# EAGLE design optiMiceV2 (EAGLE 9.6.2)
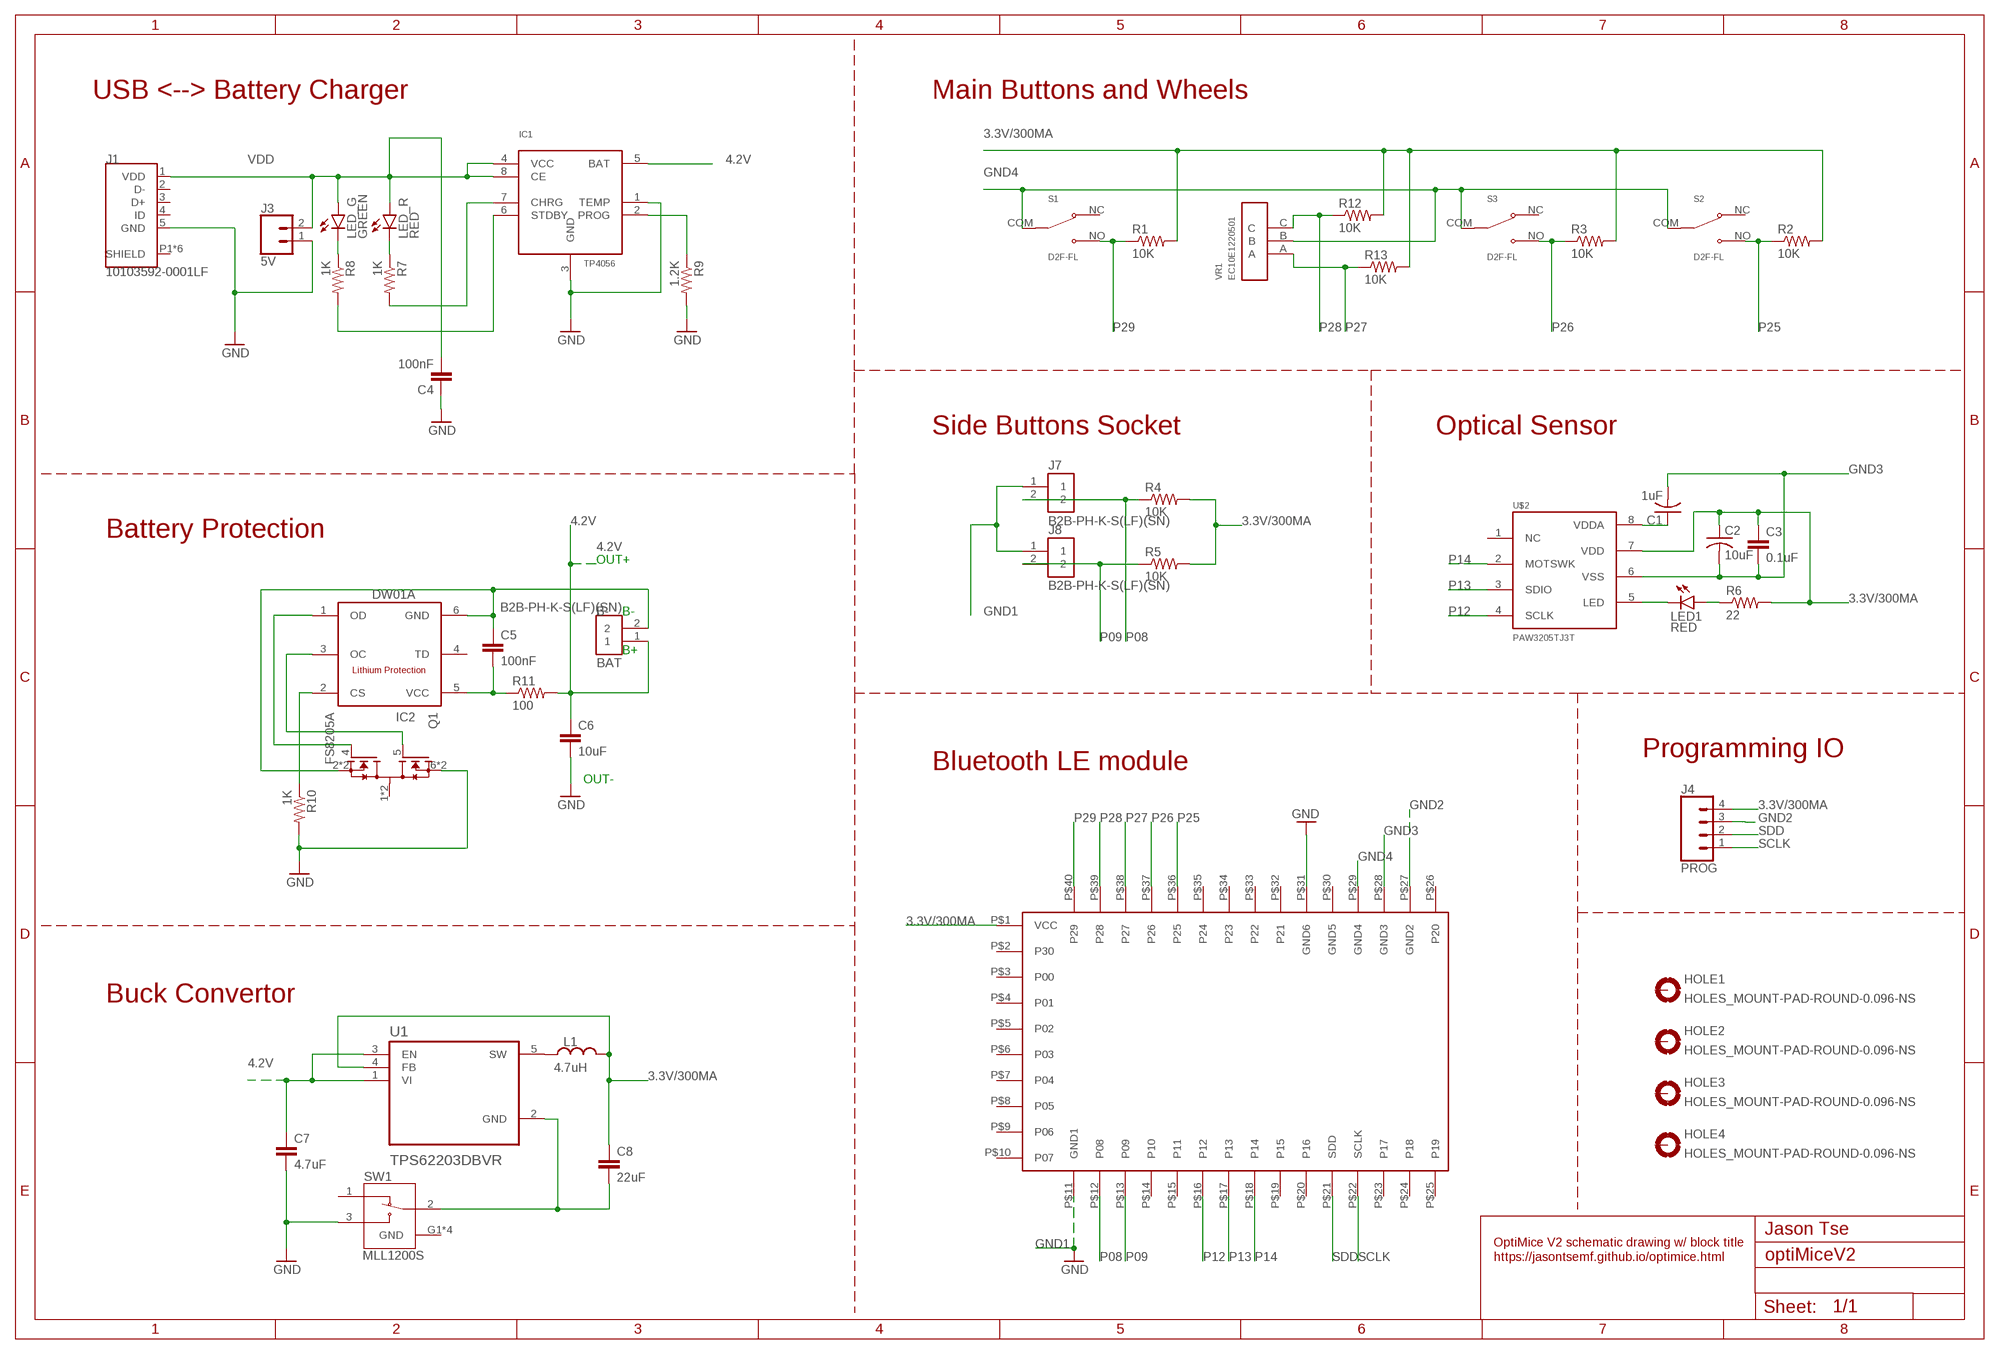
[diagram p0: schematic, sheet 1]

## Parts
BAT  B2B-PH-K-S(LF)(SN)  [JST_B2B-PH-K-S(LF)(SN)]
C1  1uF  C-USC0805K  [C0805K]
C2  10uF  C-USC0805K  [C0805K]
C3  0.1uF  C-EUC0805K  [C0805K]
C4  100nF  C-EUC0805  [C0805]
C5  100nF  C-EUC0805  [C0805]
C6  10uF  C-EUC0805  [C0805]
C7  4.7uF  C-EUC0805  [C0805]
C8  22uF  C-EUC0805  [C0805]
HOLE1  HOLES_MOUNT-PAD-ROUND-0.096-NS  [HOLES_096-PAD-NS]
HOLE2  HOLES_MOUNT-PAD-ROUND-0.096-NS  [HOLES_096-PAD-NS]
HOLE3  HOLES_MOUNT-PAD-ROUND-0.096-NS  [HOLES_096-PAD-NS]
HOLE4  HOLES_MOUNT-PAD-ROUND-0.096-NS  [HOLES_096-PAD-NS]
IC1  TP4056  [SOP-8]
IC2  DW01A  [SOT23-6]
J1  10103592-0001LF  [AMPHENOL_10103592-0001LF]
J3  5V  CONN_02  [1X02]
J4  PROG  CONN_04  [1X04]
J7  B2B-PH-K-S(LF)(SN)  [JST_B2B-PH-K-S(LF)(SN)]
J8  B2B-PH-K-S(LF)(SN)  [JST_B2B-PH-K-S(LF)(SN)]
L1  4.7uH  L_CHIP-0805(2012-METRIC)  [INDC2009X120]
LED1  RED  LED5MM  [LED5MM]
LED_G  GREEN  LEDCHIP-LED0805  [CHIP-LED0805]
LED_R  RED  LEDCHIP-LED0805  [CHIP-LED0805]
Q1  FS8205A  [SOP65P640X120-8N]
R1  10K  R-US_R0805  [R0805]
R2  10K  R-US_R0805  [R0805]
R3  10K  R-US_R0805  [R0805]
R4  10K  R-US_R0805  [R0805]
R5  10K  R-US_R0805  [R0805]
R6  22  R-US_R0805  [R0805]
R7  1K  R-US_R0805  [R0805]
R8  1K  R-US_R0805  [R0805]
R9  1.2K  R-US_R0805  [R0805]
R10  1K  R-US_R0805  [R0805]
R11  100  R-US_R0805  [R0805]
R12  10K  R-US_R0805  [R0805]
R13  10K  R-US_R0805  [R0805]
S1  D2F-FL  [SW_D2F-FL]
S2  D2F-FL  [SW_D2F-FL]
S3  D2F-FL  [SW_D2F-FL]
SW1  MLL1200S  [SW_MLL1200S]
U1  TPS62203DBVR  [SOT95P280X145-5N]
U$1  NRF51822-02  [WT51822-S2]
U$2  PAW3205TJ3T  [PAW3205]
VR1  EC10E1220501  [TRIM_EC10E1220501]

## Nets
3.3V/300MA: C2.1 C3.1 C8.1 J4.4 L1.2 R1.2 R2.2 R3.2 R4.2 R5.2 R6.2 R12.2 R13.2 U1.4(FB) U$1.P$1(VCC) U$2.7(VDD)
4.2V: BAT.1 C6.1 C7.1 IC1.5(BAT) R11.2 U1.1(VI) U1.3(EN)
B-: BAT.2 C5.1 IC2.6(GND) Q1.2(S1) Q1.3(S1)
GND: C4.1 C6.2 C7.2 IC1.1(TEMP) IC1.3(GND) J1.5(GND) J3.1 Q1.6(S2) Q1.7(S2) R9.2 R10.2 SW1.3 U$1.P$31(GND6)
GND1: J7.1 J8.1 U$1.P$11(GND1) ; supply symbol labelled GND
GND2: J4.3 U$1.P$27(GND2)
GND3: C1.2 C2.2 C3.2 U$1.P$28(GND3) U$2.6(VSS)
GND4: S1.COM S2.COM S3.COM U$1.P$29(GND4) VR1.B
N$3: C1.1 U$2.8(VDDA)
N$7: LED1.A R6.1
N$9: IC1.7(CHRG) R7.2
N$11: LED1.K(C) U$2.5(LED)
N$14: IC1.6(STDBY) R8.2
N$15: LED_R.C R7.1
N$16: LED_G.C R8.1
N$17: C8.2 SW1.2 U1.2(GND)
N$18: IC1.2(PROG) R9.1
N$19: L1.1 U1.5(SW)
N$20: IC2.3(OC) Q1.5(G2)
N$22: IC2.1(OD) Q1.4(G1)
N$23: C5.2 IC2.5(VCC) R11.1
N$24: IC2.2(CS) R10.1
P08: J7.2 R4.1 U$1.P$12(P08)
P09: J8.2 R5.1 U$1.P$13(P09)
P12: U$1.P$16(P12) U$2.4(SCLK)
P13: U$1.P$17(P13) U$2.3(SDIO)
P14: U$1.P$18(P14) U$2.2(MOTSWK)
P25: R2.1 S2.NO U$1.P$36(P25)
P26: R3.1 S3.NO U$1.P$37(P26)
P27: R13.1 U$1.P$38(P27) VR1.A
P28: R12.1 U$1.P$39(P28) VR1.C
P29: R1.1 S1.NO U$1.P$40(P29)
SCLK: J4.1 U$1.P$22(SCLK)
SDD: J4.2 U$1.P$21(SDD)
VDD: C4.2 IC1.4(VCC) IC1.8(CE) J1.1(VDD) J3.2 LED_G.A LED_R.A
Unconnected: HOLE1.B096(MOUNT) HOLE2.B096(MOUNT) HOLE3.B096(MOUNT) HOLE4.B096(MOUNT) IC2.4(TD) J1.2(D-) J1.3(D+) J1.4(ID) Q1.1(D12) Q1.8(D12) S1.NC S2.NC S3.NC SW1.1 U$1.P$2(P30) U$1.P$3(P00) U$1.P$4(P01) U$1.P$5(P02) U$1.P$6(P03) U$1.P$7(P04) U$1.P$8(P05) U$1.P$9(P06) U$1.P$10(P07) U$1.P$14(P10) U$1.P$15(P11) U$1.P$19(P15) U$1.P$20(P16) U$1.P$23(P17) U$1.P$24(P18) U$1.P$25(P19) U$1.P$26(P20) U$1.P$30(GND5) U$1.P$32(P21) U$1.P$33(P22) U$1.P$34(P23) U$1.P$35(P24) U$2.1(NC)

## Notes on the sheet
- USB <--> Battery Charger | Main Buttons and Wheels
- Side Buttons Socket | Optical Sensor
- Battery Protection
- OUT+
- B-
- B+
- Programming IO
- Bluetooth LE module
- OUT-
- Buck Convertor
- Jason Tse
- OptiMice V2 schematic drawing w/ block title
  https://jasontsemf.github.io/optimice.html

## Power pins joined to a net without a drawn wire
GND: SW1.G1(GND) SW1.G2(GND) SW1.G3(GND) SW1.G4(GND)
SHIELD: J1.P1(SHIELD) J1.P2(SHIELD) J1.P3(SHIELD) J1.P4(SHIELD) J1.P5(SHIELD) J1.P6(SHIELD)

## Library data of the parts
BAT J7 J8 = B2B-PH-K-S_LF__SN_:B2B-PH-K-S(LF)(SN): PH Series 2 Position 2 mm Pitch Through Hole Top Entry Shrouded Header Check prices <https://pricing.snapeda.com/parts/B2B-PH-K-S%28LF%29%28SN%29/JST%20Sales/view-part?ref=eda>; AVAILABILITY: Good; DESCRIPTION: Connector Header Through Hole 2 position 0.079 (2.00mm); MF: JST Sales; MP: B2B-PH-K-S(LF)(SN); PACKAGE: None; PRICE: None; PURCHASE-URL: https://pricing.snapeda.com/search/part/B2B-PH-K-S(LF)(SN)/?ref=eda
C1 C2 = rcl:C-US: CAPACITOR, American symbol; SPICEPREFIX: C
C3-C8 = rcl:C-EU: CAPACITOR, European symbol; SPICEPREFIX: C
HOLE1-HOLE4 = 52101-101-REV-A_v16:HOLES_MOUNT-PAD-ROUND-: MOUNTING PAD, round; BOM: EXCLUDE
IC1 = TP4056:TP4056; AVAILABILITY: Unavailable; DESCRIPTION: Complete single cell Li-Ion battery with a constant current / constant voltage linear charger; MF: NanJing Top Power ASIC Corp.; MP: TP4056; PACKAGE: Package; PRICE: None
IC2 = DW01A:DW01A; AVAILABILITY: Unavailable; DESCRIPTION: One Cell Lithium-ion/Polymer Battery Protection IC; MF: Fortune Semiconductor; MP: DW01A; PACKAGE: SOT-23-6 Fortune Semiconductor; PRICE: None
J1 = 10103592-0001LF:10103592-0001LF: Conn Micro USB Type B RCP 5 POS 0.65mm Solder RA SMD 5 Terminal 1 Port T/R Check prices <https://pricing.snapeda.com/parts/10103592-0001LF/Amphenol%20ICC%20%28FCI%29/view-part?ref=eda>; AVAILABILITY: Good; DESCRIPTION: USB - micro B USB 2.0 Receptacle Connector 5 Position Surface Mount, Right Angle; Through Hole; MF: Amphenol ICC (FCI); MP: 10103592-0001LF; PACKAGE: None; PRICE: None; PURCHASE-URL: https://pricing.snapeda.com/search/part/10103592-0001LF/?ref=eda
J3 = SparkFun-Connectors:CONN_02: Multi connection point. Often used as Generic Header-pin footprint for 0.1 inch spaced/style header connections On any of the 0.1 inch spaced packages, you can populate with these: Break Away Headers - Straight <https://www.sparkfun.com/products/116> (PRT-00116) Break Away Male Headers - Right Angle <https://www.sparkfun.com/products/553> (PRT-00553) Female Headers <https://www.sparkfun.com/products/115> (PRT-00115) Break Away Headers - Machine Pin <https://www.sparkfun.com/products/117> (PRT-00117) Break Away Female Headers - Swiss Machine Pin <https://www.sparkfun.com/products/743> (PRT-00743) For SCREWTERMINALS and SPRING TERMINALS visit here: Screw Terimnals on SparkFun.com <https://www.sparkfun.com/search/results?term=Screw+Terminals> (5mm/3.5mm/2.54mm spacing) This device is also useful as a general connection point to wire up your design to another part of your project. Our various solder wires solder well into these plated through hole pads. Hook-Up Wire - Assortment (Stranded, 22 AWG) <https://www.sparkfun.com/products/11375> (PRT-11375) Hook-Up Wire - Assortment (Solid Core, 22 AWG) <https://www.sparkfun.com/products/11367> (PRT-11367) View the entire wire category on our website here <https://www.sparkfun.com/categories/141> Special notes: Molex polarized connector foot print use with: PRT-08233 with associated crimp pins and housings. 2.54_SCREWTERM for use with PRT-10571. 3.5mm Screw Terminal footprints for PRT-08084 5mm Screw Terminal footprints for use with PRT-08432
J4 = SparkFun-Connectors:CONN_04: Multi connection point. Often used as Generic Header-pin footprint for 0.1 inch spaced/style header connections On any of the 0.1 inch spaced packages, you can populate with these: Break Away Headers - Straight <https://www.sparkfun.com/products/116> (PRT-00116) Break Away Male Headers - Right Angle <https://www.sparkfun.com/products/553> (PRT-00553) Female Headers <https://www.sparkfun.com/products/115> (PRT-00115) Break Away Headers - Machine Pin <https://www.sparkfun.com/products/117> (PRT-00117) Break Away Female Headers - Swiss Machine Pin <https://www.sparkfun.com/products/743> (PRT-00743) For SCREWTERMINALS and SPRING TERMINALS visit here: Screw Terimnals on SparkFun.com <https://www.sparkfun.com/search/results?term=Screw+Terminals> (5mm/3.5mm/2.54mm spacing) This device is also useful as a general connection point to wire up your design to another part of your project. Our various solder wires solder well into these plated through hole pads. Hook-Up Wire - Assortment (Stranded, 22 AWG) <https://www.sparkfun.com/products/11375> (PRT-11375) Hook-Up Wire - Assortment (Solid Core, 22 AWG) <https://www.sparkfun.com/products/11367> (PRT-11367) View the entire wire category on our website here <https://www.sparkfun.com/categories/141> Special notes: Molex polarized connector foot print use with SKU : PRT-08231 with associated crimp pins and housings. 1MM SMD Version SKU: PRT-10208; PROD_ID: CONN-09696
L1 = Inductor:L: Inductor Fixed - Generic; CATEGORY: Inductor; SUB-CATEGORY: Fixed
LED1 LED_G LED_R = led:LED: LED OSRAM: - CHIPLED LG R971, LG N971, LY N971, LG Q971, LY Q971, LO R971, LY R971 LH N974, LH R974 LS Q976, LO Q976, LY Q976 LO Q996 - Hyper CHIPLED LW Q18S LB Q993, LB Q99A, LB R99A - SideLED LS A670, LO A670, LY A670, LG A670, LP A670 LB A673, LV A673, LT A673, LW A673 LH A674 LY A675 LS A676, LA A676, LO A676, LY A676, LW A676 LS A679, LY A679, LG A679 - Hyper Micro SIDELED® LS Y876, LA Y876, LO Y876, LY Y876 LT Y87S - SmartLED LW L88C, LW L88S LB L89C, LB L89S, LG L890 LS L89K, LO L89K, LY L89K LS L896, LA L896, LO L896, LY L896 - TOPLED LS T670, LO T670, LY T670, LG T670, LP T670 LSG T670, LSP T670, LSY T670, LOP T670, LYG T670 LG T671, LOG T671, LSG T671 LB T673, LV T673, LT T673, LW T673 LH T674 LS T676, LA T676, LO T676, LY T676, LB T676, LH T676, LSB T676, LW T676 LB T67C, LV T67C, LT T67C, LS T67K, LO T67K, LY T67K, LW E67C LS E67B, LA E67B, LO E67B, LY E67B, LB E67C, LV E67C, LT E67C LW T67C LS T679, LY T679, LG T679 LS T770, LO T770, LY T770, LG T770, LP T770 LB T773, LV T773, LT T773, LW T773 LH T774 LS E675, LA E675, LY E675, LS T675 LS T776, LA T776, LO T776, LY T776, LB T776 LHGB T686 LT T68C, LB T68C - Hyper Mini TOPLED® LB M676 - Mini TOPLED Santana® LG M470 LS M47K, LO M47K, LY M47K Source: http://www.osram.convergy.de LUXEON: - LUMILED® LXK2-PW12-R00, LXK2-PW12-S00, LXK2-PW14-U00, LXK2-PW14-V00 LXK2-PM12-R00, LXK2-PM12-S00, LXK2-PM14-U00 LXK2-PE12-Q00, LXK2-PE12-R00, LXK2-PE12-S00, LXK2-PE14-T00, LXK2-PE14-U00 LXK2-PB12-K00, LXK2-PB12-L00, LXK2-PB12-M00, LXK2-PB14-N00, LXK2-PB14-P00, LXK2-PB14-Q00 LXK2-PR12-L00, LXK2-PR12-M00, LXK2-PR14-Q00, LXK2-PR14-R00 LXK2-PD12-Q00, LXK2-PD12-R00, LXK2-PD12-S00 LXK2-PH12-R00, LXK2-PH12-S00 LXK2-PL12-P00, LXK2-PL12-Q00, LXK2-PL12-R00 Source: www.luxeon.com KINGBRIGHT: KA-3528ASYC Source: www.kingbright.com
Q1 = FS8205A:FS8205A: N/A; AVAILABILITY: Unavailable; MF: Fortune Semiconductor; MP: FS8205A; PACKAGE: Package; PRICE: None
R1-R13 = rcl:R-US_: RESISTOR, American symbol; SPICEPREFIX: R
S1-S3 = D2F-FL:D2F-FL: SWITCH SNAP ACTION SPDT 1A 125V Check prices <https://pricing.snapeda.com/parts/D2F-FL/Omron%20Electronics/view-part?ref=eda>; AVAILABILITY: Good; DESCRIPTION: SWITCH SNAP ACTION SPDT 1A 125V; MF: Omron Electronics; MP: D2F-FL; PACKAGE: MQFP-44 Omron; PRICE: None; PURCHASE-URL: https://pricing.snapeda.com/search/part/D2F-FL/?ref=eda
SW1 = MLL1200S:MLL1200S: Switch Slide SPDT Side Slide 0.3A 4VDC Gull Wing SMD Box Check prices <https://pricing.snapeda.com/parts/MLL1200S/TE%20Connectivity/view-part?ref=eda>; AVAILABILITY: Good; COMMENT: 1437575-1; DESCRIPTION: Slide Switch SPDT Surface Mount, Right Angle; MF: TE Connectivity; MP: MLL1200S; PACKAGE: None; PRICE: None; PURCHASE-URL: https://pricing.snapeda.com/search/part/MLL1200S/?ref=eda
U1 = TPS62203DBVR:TPS62203DBVR: Check prices <https://pricing.snapeda.com/parts/TPS62203DBVR/Texas%20Instruments/view-part?ref=eda>; AVAILABILITY: Good; DESCRIPTION: 3.3-V Output, 300-mA, 95% Efficient Step-Down Converter in SOT-23 5-SOT-23 -40 to 85; MF: Texas Instruments; MP: TPS62203DBVR; PACKAGE: SOT-23-5 Texas Instruments; PRICE: None; PURCHASE-URL: https://pricing.snapeda.com/search/part/TPS62203DBVR/?ref=eda
U$1 = nRF51-02:NRF51822-02
U$2 = PAW3205:PAW3205: Check prices <https://pricing.snapeda.com/parts/ADNS-2080/Broadcom%20Limited/view-part?ref=eda>; AVAILABILITY: Bad; DESCRIPTION: Optical Sensor 8-DIP Module; MF: Broadcom Limited; MP: ADNS-2080; PACKAGE: DIP-8 Broadcom Limited; PRICE: None
VR1 = EC10E1220501:EC10E1220501: Encoders 10mm 12 Res 24 Dtent 9mm mount height Check prices <https://pricing.snapeda.com/parts/EC10E1220501/ALPS/view-part?ref=eda>; AVAILABILITY: Good; DESCRIPTION: Encoders 10mm 12 Res 24 Dtent 9mm mount height; MF: ALPS; MP: EC10E1220501; PACKAGE: None; PRICE: None; PURCHASE-URL: https://pricing.snapeda.com/search/part/EC10E1220501/?ref=eda

## Board
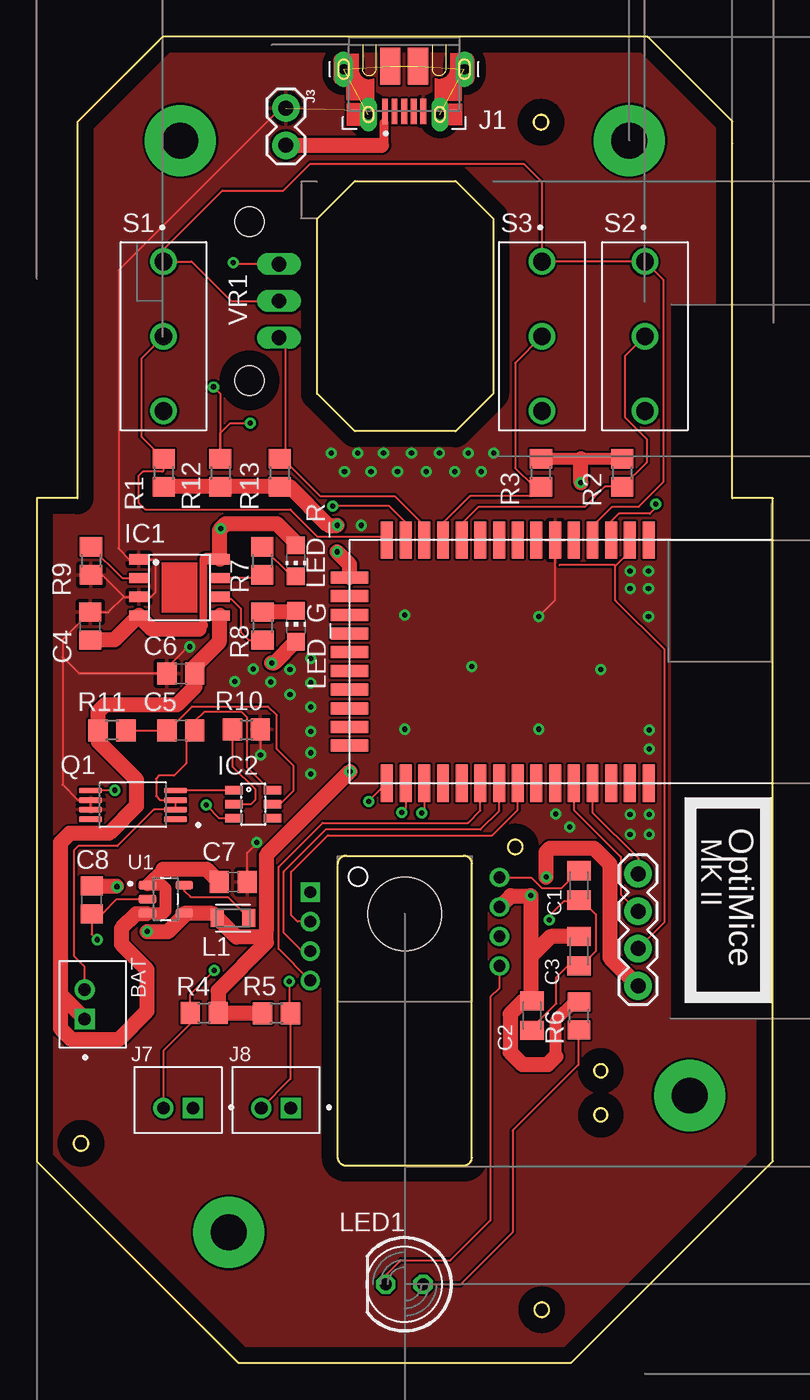
[diagram p1: board, top side]
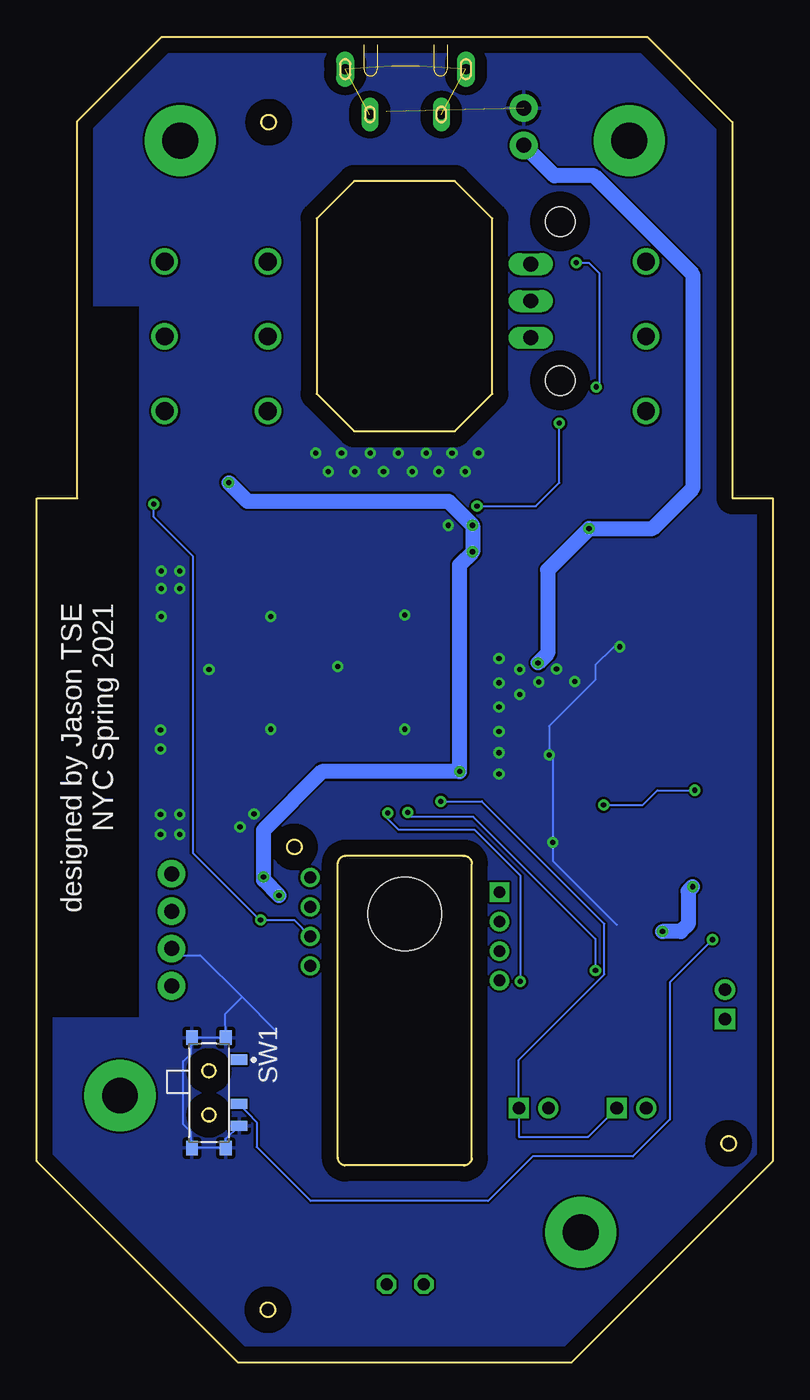
[diagram p2: board, bottom side, seen from below]

Size 50 x 90.1 mm. Coordinates in mm from the lower left corner, seen from the top.
Outline: 38.44,16.41 arc165 38.3,17.29 arc195 38.44,16.41
Outline: 38.44,16.41 38.44,16.41
Outline: 34.75,84.24 arc180 33.75,84.36 33.75,84.36 arc7 33.75,84.3 arc133 34.6,83.94 arc39 34.75,84.24
Outline: 34.75,84.24 34.75,84.24
Outline: 20.95,34.45 20.9,34.44
Outline: 20.9,34.44 arc-15 21.05,34.45 29,34.45 arc-80 29.54,34
Outline: 20.9,34.44 arc80 20.45,33.9 20.45,13.9 arc85 21,13.4 29.05,13.4 arc85 29.55,13.95 29.55,33.95
Outline: 38.44,19.41 arc165 38.3,20.29 arc114 37.9,19.64 arc66 38.32,19.39 38.32,19.39 arc15 38.44,19.41
Outline: 33.8,3.66 33.8,3.66 arc-80 34.27,4.1 arc-204 34.12,3.13 arc-76 33.8,3.66
Outline: 19.05,65.85 19.05,77.75 21.6,80.3 28.45,80.3 31,77.75 31,65.85 28.45,63.3 21.6,63.3 19.05,65.85
Outline: 32,35.11 arc7 32,35.05 arc43 32.14,34.7 arc129 33,34.99 33,34.99 arc180 32,35.11 32,35.11
Outline: 28.7,87.58 28.7,88.22 28.7,88.25 28.7,88.28 28.71,88.31 28.72,88.34 28.73,88.37 28.75,88.39 28.76,88.42 28.78,88.44 28.8,88.47 28.82,88.49 28.85,88.51 28.88,88.52 28.9,88.54 28.93,88.55 28.96,88.56 28.99,88.56 29.02,88.57 29.05,88.57 29.08,88.57 29.11,88.56 29.14,88.56 29.17,88.55 29.2,88.54 29.23,88.52 29.25,88.51 29.27,88.49 29.3,88.47 29.32,88.44 29.34,88.42 29.35,88.39 29.37,88.37 29.38,88.34 29.39,88.31 29.39,88.28 29.4,88.25 29.4,88.22 29.4,87.58 29.4,87.55 29.39,87.52 29.39,87.49 29.38,87.46 29.37,87.43 29.35,87.41 29.34,87.38 29.32,87.35 29.3,87.33 29.27,87.31 29.25,87.29 29.23,87.28 29.2,87.26 29.17,87.25 29.14,87.24 29.11,87.23 29.08,87.23 29.05,87.23 29.02,87.23 28.99,87.23 28.96,87.24 28.93,87.25 28.9,87.26 28.88,87.28 28.85,87.29 28.82,87.31 28.8,87.33 28.78,87.35 28.76,87.38 28.75,87.41 28.73,87.43 28.72,87.46 28.71,87.49 28.7,87.52 28.7,87.55 28.7,87.58
Outline: 27.05,84.62 27.05,85.02 27.05,85.05 27.05,85.08 27.06,85.1 27.07,85.13 27.08,85.16 27.09,85.18 27.11,85.21 27.13,85.23 27.14,85.25 27.17,85.27 27.19,85.29 27.21,85.3 27.24,85.31 27.26,85.32 27.29,85.33 27.32,85.34 27.35,85.34 27.38,85.34 27.4,85.34 27.43,85.34 27.46,85.33 27.49,85.32 27.51,85.31 27.54,85.3 27.56,85.29 27.58,85.27 27.61,85.25 27.62,85.23 27.64,85.21 27.66,85.18 27.67,85.16 27.68,85.13 27.69,85.1 27.7,85.08 27.7,85.05 27.7,85.02 27.7,84.62 27.7,84.59 27.7,84.56 27.69,84.54 27.68,84.51 27.67,84.48 27.66,84.46 27.64,84.43 27.62,84.41 27.61,84.39 27.58,84.37 27.56,84.35 27.54,84.34 27.51,84.32 27.49,84.31 27.46,84.31 27.43,84.3 27.4,84.3 27.38,84.29 27.35,84.3 27.32,84.3 27.29,84.31 27.26,84.31 27.24,84.32 27.21,84.34 27.19,84.35 27.17,84.37 27.14,84.39 27.13,84.41 27.11,84.43 27.09,84.46 27.08,84.48 27.07,84.51 27.06,84.54 27.05,84.56 27.05,84.59 27.05,84.62
Outline: 2.5,14.87 arc174 3.5,14.87 arc180 2.5,14.93 2.5,14.87
Outline: 20.5,87.58 20.5,88.22 20.5,88.25 20.5,88.28 20.51,88.31 20.52,88.34 20.53,88.37 20.55,88.39 20.56,88.42 20.58,88.44 20.6,88.47 20.62,88.49 20.65,88.51 20.68,88.52 20.7,88.54 20.73,88.55 20.76,88.56 20.79,88.56 20.82,88.57 20.85,88.57 20.88,88.57 20.91,88.56 20.94,88.56 20.97,88.55 21,88.54 21.02,88.52 21.05,88.51 21.07,88.49 21.1,88.47 21.12,88.44 21.14,88.42 21.15,88.39 21.17,88.37 21.18,88.34 21.19,88.31 21.2,88.28 21.2,88.25 21.2,88.22 21.2,87.58 21.2,87.55 21.2,87.52 21.19,87.49 21.18,87.46 21.17,87.43 21.15,87.41 21.14,87.38 21.12,87.35 21.1,87.33 21.07,87.31 21.05,87.29 21.02,87.28 21,87.26 20.97,87.25 20.94,87.24 20.91,87.23 20.88,87.23 20.85,87.23 20.82,87.23 20.79,87.23 20.76,87.24 20.73,87.25 20.7,87.26 20.68,87.28 20.65,87.29 20.62,87.31 20.6,87.33 20.58,87.35 20.56,87.38 20.55,87.41 20.53,87.43 20.52,87.46 20.51,87.49 20.5,87.52 20.5,87.55 20.5,87.58
Outline: 22.2,84.62 22.2,85.02 22.2,85.05 22.2,85.08 22.21,85.1 22.22,85.13 22.23,85.16 22.24,85.18 22.26,85.21 22.28,85.23 22.3,85.25 22.32,85.27 22.34,85.29 22.36,85.3 22.39,85.31 22.41,85.32 22.44,85.33 22.47,85.34 22.5,85.34 22.52,85.34 22.55,85.34 22.58,85.34 22.61,85.33 22.64,85.32 22.66,85.31 22.69,85.3 22.71,85.29 22.73,85.27 22.75,85.25 22.77,85.23 22.79,85.21 22.81,85.18 22.82,85.16 22.83,85.13 22.84,85.1 22.84,85.08 22.85,85.05 22.85,85.02 22.85,84.62 22.85,84.59 22.84,84.56 22.84,84.54 22.83,84.51 22.82,84.48 22.81,84.46 22.79,84.43 22.77,84.41 22.75,84.39 22.73,84.37 22.71,84.35 22.69,84.34 22.66,84.32 22.64,84.31 22.61,84.31 22.58,84.3 22.55,84.3 22.52,84.29 22.5,84.3 22.47,84.3 22.44,84.31 22.41,84.31 22.39,84.32 22.36,84.34 22.34,84.35 22.32,84.37 22.3,84.39 22.28,84.41 22.26,84.43 22.24,84.46 22.23,84.48 22.22,84.51 22.21,84.54 22.2,84.56 22.2,84.59 22.2,84.62
Outline: 0,58.75 0,13.7 13.7,0 36.3,0 50,13.7 50,58.75 47.25,58.75 47.25,84.35 41.5,90.1 8.55,90.1 2.75,84.3 2.75,58.75 0,58.75
Copper layers (1*16): Top 0.035mm / dielectric 0.93mm / Bottom 0.035mm
Design rules "default *": minimum track width 6mil, minimum drill 0.35mm, track to track 6mil, track to pad 6mil, pad to pad 6mil, via to via 6mil, smd to smd 6mil, copper to edge 40mil, drill to drill 6mil, minimum pad ring 10mil, minimum via ring 8mil, stop-mask expansion 4mil, vias tented up to drill 0mil, thermal gap 10mil
Holes 2 mm at 14.45,77.55 14.45,66.75 14.45,66.75 14.45,77.55 14.45,66.75 14.45,77.55 14.45,66.75 14.45,77.55 14.45,66.75 14.45,77.55 14.45,66.75 14.45,77.55
Holes 1 mm at 34.25,84.3 34.3,3.6 32.5,35.05 3,14.9
Holes 5 mm at 25,30.5 25,30.5 25,30.5 25,30.5 25,30.5 25,30.5
Holes 0.9 mm at 38.31,16.84 38.31,19.84 38.31,19.84 38.31,16.84 38.31,19.84 38.31,16.84 38.31,19.84 38.31,16.84 38.31,19.84 38.31,16.84 38.31,19.84 38.31,16.84

### Footprints (pad centres in the part's own frame; a part is rotated, then mirrored left to right if it is on the bottom)
JST_B2B-PH-K-S(LF)(SN) = drill 0.86 square: 1 1,-0.55 | drill 0.86: 2 -1,-0.55
C0805K = smd 1.3 x 1.6: 1 -1,0; 2 1,0
C0805 = smd 1.3 x 1.5: 1 -0.95,0; 2 0.95,0
HOLES_096-PAD-NS = drill 2.438 pad 4.826: B096 0,0
SOP-8 = smd 1.3 x 0.7: 1 -2.75,1.905; 2 -2.75,0.635; 3 -2.75,-0.635; 4 -2.75,-1.905; 5 2.75,-1.905; 6 2.75,-0.635; 7 2.75,0.635; 8 2.75,1.905
SOT23-6 = smd 0.55 x 1.2: 1 -0.95,-1.3; 2 0,-1.3; 3 0.95,-1.3; 4 0.95,1.3; 5 0,1.3; 6 -0.95,1.3
AMPHENOL_10103592-0001LF = smd 0.4 x 1.75: 1 1.3,2.875; 2 0.65,2.875; 3 0,2.875; 4 -0.65,2.875; 5 -1.3,2.875 | drill 0.65 pad 0.8 long: P1 -2.425,3.08; P2 2.425,3.08 | drill 0.7 pad 1.05 long: P3 -4.1,0; P6 4.1,0 | smd 1.375 x 2.5: P4 -0.938,-0.2; P5 0.938,-0.2
1X02 = drill 1.016 pad 1.88: 1 0,0; 2 2.54,0
1X04 = drill 1.016 pad 1.88: 1 0,0; 2 2.54,0; 3 5.08,0; 4 7.62,0
INDC2009X120 = smd 0.876 x 1.21: 1 -1.067,0; 2 1.067,0
LED5MM = drill 0.813 octagon: A -1.27,0; K 1.27,0
CHIP-LED0805 = smd 1.2 x 1.2: A 0,-1.05; C 0,1.05
SOP65P640X120-8N = smd 1.56 x 0.4: 1 -2.88,0.975; 2 -2.88,0.325; 3 -2.88,-0.325; 4 -2.88,-0.975; 5 2.88,-0.975; 6 2.88,-0.325; 7 2.88,0.325; 8 2.88,0.975
R0805 = smd 1.3 x 1.5: 1 -0.95,0; 2 0.95,0
SW_D2F-FL = drill 1.2: COM -5.08,0; NC 5.08,0; NO 0,0
SW_MLL1200S = smd 0.7 x 1.1: 1 -2.25,2.05; 2 0.75,2.05; 3 2.25,2.05 | smd 1 x 0.8: G1 -3.75,1.15; G2 3.75,1.15; G3 -3.75,-1.15; G4 3.75,-1.15 | hole 0.9: -1.5,0; 1.5,0
SOT95P280X145-5N = smd 1.21 x 0.59: 1 -1.255,0.95; 2 -1.255,0; 3 -1.255,-0.95; 4 1.255,-0.95; 5 1.255,0.95
WT51822-S2 = smd 2.54 x 0.81: P$1 0,-2.54; P$2 0,-3.81; P$3 0,-5.08; P$4 0,-6.35; P$5 0,-7.62; P$6 0,-8.89; P$7 0,-10.16; P$8 0,-11.43; P$9 0,-12.7; P$10 0,-13.97 | smd 0.81 x 2.54: P$11 2.54,-16.51; P$12 3.81,-16.51; P$13 5.08,-16.51; P$14 6.35,-16.51; P$15 7.62,-16.51; P$16 8.89,-16.51; P$17 10.16,-16.51; P$18 11.43,-16.51; P$19 12.7,-16.51; P$20 13.97,-16.51; P$21 15.24,-16.51; P$22 16.51,-16.51; P$23 17.78,-16.51; P$24 19.05,-16.51; P$25 20.32,-16.51; P$26 20.32,0; P$27 19.05,0; P$28 17.78,0; P$29 16.51,0; P$30 15.24,0; P$31 13.97,0; P$32 12.7,0; P$33 11.43,0; P$34 10.16,0; P$35 8.89,0; P$36 7.62,0; P$37 6.35,0; P$38 5.08,0; P$39 3.81,0; P$40 2.54,0
PAW3205 = drill 0.8 square: 1 -6.425,1.47 | drill 0.8: 2 -6.425,-0.53; 3 -6.425,-2.53; 4 -6.425,-4.53; 5 6.425,-3.53; 6 6.425,-1.53; 7 6.425,0.47; 8 6.425,2.47 | hole 5: 0,0
TRIM_EC10E1220501 = drill 1 long: A -2.5,0; B 0,0; C 2.5,0 | hole 2: 5.4,2; -5.4,2

### Placement (x,y rotation side)
BAT  3.8,24.35 270 top
C1  36.83,32.43 270 top
C2  33.63,23.58 270 top
C3  36.83,27.96 270 top
C4  3.62,50.06 270 top
C5  9.79,42.97 180 top
C6  9.79,46.82 180 top
C7  13.34,32.67 0 top
C8  3.73,31.44 270 top
HOLE1  9.75,83.05 0 top
HOLE2  40.25,83.05 0 top
HOLE3  13.05,8.85 0 top
HOLE4  44.35,18.15 0 top
IC1  9.69,52.68 0 top
IC2  14.7,37.95 270 top
J1  24.95,87.9 180 top
J3  16.92,85.26 270 top
J4  40.84,33.22 270 top
J7  9.6,17.85 0 top
J8  16.25,17.85 0 top
L1  13.33,30.22 180 top
LED1  24.97,5.33 180 top
LED_G  17.6,50.04 0 top
LED_R  17.59,54.49 180 top
Q1  6.53,37.91 180 top
R1  8.61,60.47 270 top
R2  39.78,60.47 90 top
R3  34.25,60.47 90 top
R4  11.37,23.77 0 top
R5  16.28,23.74 180 top
R6  36.83,23.57 90 top
R7  15.32,54.49 270 top
R8  15.33,50.06 270 top
R9  3.68,54.49 270 top
R10  14.24,43.02 0 top
R11  5.11,42.97 180 top
R12  12.47,60.47 270 top
R13  16.49,60.47 270 top
S1  8.61,69.74 270 top
S2  41.31,69.74 270 top
S3  34.31,69.74 270 top
SW1  38.31,18.34 270 bottom
U1  8.76,31.5 0 top
U$1  21.24,55.9 0 top
U$2  25,30.5 0 top
VR1  16.45,72.15 90 top

### Tracks (layer width: path | path; a pad name or v marks a point on that pad's centre or on a via)
3.3V/300MA  (via drill 0.35)
  Top 0.152: 15.07,28.92 15.6,29.45 | 33.56,24.58 C2.1 33.03,24.58 | 33.56,27.61 33.56,27.39 | L1.2 11.96,30.52 | 9.98,30.52 U1.4 | 5.41,32.39 v5.45,32.35 | 15.3,23.77 R5.2 | 17.19,59.52 R13.2 | 36.95,61.42 R3.2 | 21.25,54.25 21.24,54.24
  Top 0.813: R6.2 36.53,24.52 35.26,23.25 35.26,20.8 | R2.2 R3.2
  Top 1.016: 21.24,54.14 21.25,54.15 21.25,54.25 v20.4,55.1 | 33.56,31.74 v33.55,31.75 | v34.6,33 34.6,34.7 34.85,34.95 37.85,34.95 38.92,33.88 38.92,27.52 J4.4 | v21.27,40.17 15.6,34.5 15.6,29.45 15.6,28.55 12.32,25.27 R4.2 15.3,23.77 | v36.95,59.8 36.95,61.42 | 17.19,59.52 19.81,56.9 v20.4,56.9 | 15.07,28.92 13.56,28.92 L1.2 | 33.56,27.39 33.56,24.58 | 33.03,24.58 32.15,23.7 32.15,21.1 32.98,20.27 34.72,20.27 35.26,20.8 | 33.56,31.74 33.56,27.61 34.91,28.96 C3.1 | U$2.7 32.19,31.74 33.56,31.74 | R1.2 R12.2 R13.2 | 11.96,30.52 10.13,30.52 | 10.13,30.52 9.98,30.52 | v7.5,29.3 8.91,29.3 10.13,30.52 | C8.1 5.41,32.39 | 21.24,54.24 U$1.P$1
  Bottom 1.016: v33.55,31.75 34.6,32.8 v34.6,33 34.6,36.2 30.63,40.17 v21.27,40.17 21.27,54.23 v20.4,55.1 v20.4,56.9 22.05,58.55 35.7,58.55 v36.95,59.8 | v5.45,32.35 5.75,32.05 5.75,29.8 6.25,29.3 v7.5,29.3
4.2V
  Top 0.152: C6.1 10.74,45.92 | R11.2 4.2,42.93 | 8.6,30.55 8.75,30.7 | U1.3 7.46,30.5
  Top 0.813: 8.75,30.7 8.75,32.2 8.5,32.45 U1.1 8.58,33.52 | U1.3 8.6,30.55
  Top 1.016: C6.1 10.74,47.32 12.39,48.97 12.39,50.73 IC1.5 | 10.74,45.92 9.52,44.7 4.62,44.7 4.16,44.24 R11.2 | 4.2,42.93 4.2,42.18 6.76,39.62 6.76,37.82 4.92,35.98 2.23,35.98 1.61,35.36 1.61,24.76 1.62,24.75 | 1.62,24.75 1.62,22.7 2.34,21.99 5.59,21.99 7.47,23.88 7.47,26.73 5.75,28.45 5.75,29.5 6.75,30.5 7.46,30.5 | 1.62,24.75 1.62,25 3.25,23.37 BAT.1 | C7.1 11.54,33.52 8.58,33.52
B-
  Top 0.152: IC2.6 15.85,38.9 14.27,40.48 14.27,43.87 13.88,44.25 11.39,44.25 10.74,43.59 C5.1 10.14,42.37 10.14,40.72 9.32,39.9 8.3,39.9 8.1,39.7 8.1,38.5 8.37,38.23 Q1.3 Q1.2 7.96,37.58 5.48,35.1 2.8,35.1 2.56,34.86 2.56,27.6 3.25,26.91 BAT.2
GND  (via drill 0.35)  (1 unrouted)
  Top 0.152: 5.92,52.05 5.91,52.05 4.87,51.01 C4.1 1.75,49.14 1.75,47.95 | R9.2 3.75,53.61 4.36,53.61 5.92,52.05 | 2.88,46.82 C6.2 8.84,47.22 10.27,48.65 v10.4,48.65 | 2.88,46.82 2.85,46.82 | Q1.7 Q1.6 | Q1.6 3.62,38.2 | R10.2 v15.19,41.31 v15.2,41.3 | 5.92,52.05 IC1.3 7.75,52.05 8.05,52.35 8.05,54.5 7.96,54.59 IC1.1 6.29,54.59 5.55,55.33 5.55,74.24 16.57,85.26 J3.1 | Q1.6 2.8,38.23 1.75,39.28 1.75,47.95 | C7.2 14.29,34.64 14.95,35.3 v14.95,35.35 | 2.88,46.82 1.75,47.95 | U$1.P$31 35.2,55.88 35.2,51.8 v34.1,50.7
  Bottom 0.152: v14.95,35.35 14.95,41.05 v15.2,41.3 15.2,43.25 12.05,46.4 12.05,47.4 10.8,48.65 v10.4,48.65 | 14.9,35.3 v14.95,35.35 | 36.06,24.84 37.21,23.69 SW1.G1 SW1.G3 39.51,21.02 40.05,20.48 40.05,16.2 39.51,15.66 SW1.G4 SW1.G2 37.21,15.19 SW1.3 | v14.95,35.35 14.95,34.1 10.6,29.75 | 40.74,28.14 40.29,27.69 38.91,27.69 36.06,24.84 | 33.73,22.51 36.06,24.84
  other vias: 25,50.8 29.55,47.3 38.3,47.1 34.1,43.05 25,43.05 40.3,53.8 41.55,53.8 41.55,52.6 40.3,52.6 41.55,50.7 41.6,43 41.6,41.7 41.6,37.25 40.3,37.25 41.6,35.9 40.3,35.9 22.05,56.9 18.6,41.45 18.6,40 29.3,61.8 28.4,60.55 27.35,61.8 26.45,60.55 25.45,61.8 24.5,60.55 23.55,61.8 30.2,60.55 31.05,61.8 22.7,60.55 21.8,61.8 20.9,60.55 20,61.8 18.6,42.9 18.6,44.55 18.6,46.2 18.6,47.85 17.2,47.1 17.2,45.4 15.9,46.25 14.7,47.15 13.45,46.3 35.25,37.3 36.2,36.4
  pour Top: -11.35,101.21 70.44,101.21 70.44,71.91 43,71.91 43,23.4 58.68,23.4 58.65,-5.55 -11.35,-5.55
  pour Bottom: -11.35,101.15 70.5,101.15 70.5,71.85 43,71.85 43,23.4 58.6,23.4 58.6,-5.6 -11.35,-5.6
  pour Top (rank 3): 35.27,9.76 35.28,9.56 35.31,9.36 35.36,9.17 35.42,8.98 35.5,8.8 35.6,8.62 35.7,8.45 35.82,8.29 35.95,8.14 36.09,8 36.24,7.86 36.39,7.74 36.55,7.62 36.72,7.52 36.9,7.43 37.09,7.36 37.28,7.31 37.48,7.29 37.68,7.29 37.88,7.32 38.07,7.37 38.26,7.44 38.43,7.53 38.6,7.64 38.76,7.76 38.91,7.89 39.06,8.02 42.72,11.69 42.61,11.74 42.02,11.83 41.62,11.89 38.67,12.34 38.49,12.32 37.36,11.19 37.31,11.07 38.29,10.92 39.08,10.79 39.47,10.72 39.53,10.65 37.98,9.1 37.84,8.96 37.68,8.84 37.5,8.76 37.3,8.74 37.11,8.78 36.94,8.88 36.8,9.02 36.69,9.19 36.62,9.37 36.59,9.57 36.58,9.77 36.59,9.97 35.25,9.92
GND1  (via drill 0.35)
  Top 0.152: U$1.P$11 v22.55,38.16 v22.55,38.15
  Bottom 0.152: J7.1 12.55,15.35 17.25,15.35 J8.1 17.25,20.59 11.44,26.4 11.44,29.82 19.77,38.15 v22.55,38.15
GND2
  Top 0.152: J4.3 42.65,29.95 42.65,48.45 39.3,51.8 39.3,54.15 | 40.16,55.02 40.3,55.02 | 39.3,54.15 40.16,55.02 | U$1.P$27 40.29,55.14 40.16,55.02 | 39.3,54.15 39.25,54.2 35.5,54.2
GND3  (via drill 0.35)
  Top 0.152: 33.43,22.96 33.43,22.8 33.63,23 C2.2 33.63,22.75 35.29,24.41 35.29,26.17 36.08,26.96 C3.2 | 37.4,26.39 C3.2 | C3.2 36.98,26.96 37.98,27.96 37.98,30.47 37.02,31.43 C1.2 36.75,31.35 35.8,31.35 34.8,30.35 v34.8,30.1 | v42.05,58.35 42.05,58.1 41.65,57.7 39.54,57.7 39.02,57.18 U$1.P$28
  Bottom 0.152: 31.45,28.95 U$2.6 32.52,30.08 34.78,30.08 v34.8,30.1 34.85,30.1 39.4,34.65 39.4,54.8 42.05,57.45 v42.05,58.35
GND4
  Top 0.152: VR1.B 13.2,72.15 10.53,74.82 S1.COM 8.61,75.65 12.61,79.65 16.75,79.65 18.57,81.47 33.08,81.47 34.31,80.24 S3.COM S2.COM 42.55,73.58 42.55,59.83 40.9,58.18 39.08,58.18 37.75,56.85 U$1.P$29
N$3
  Top 0.152: U$2.8 33.59,32.97 34.3,32.26 35.66,32.26 C1.1
N$7
  Top 0.152: LED1.A 28.79,5.33 32.33,8.87 32.33,15.78 36.78,20.23 36.78,22.57 R6.1
N$9
  Top 0.152: R7.2 15.1,53.32 IC1.7
N$11
  Top 0.152: LED1.K 23.7,5.93 24.72,6.95 28.1,6.95 30.82,9.67 30.82,24.84 31.43,25.45 U$2.5
N$14
  Top 0.152: IC1.6 12.59,51.9 13.2,51.9 13.85,51.25 13.85,49.65 14.39,49.11 R8.2
N$15
  Top 0.152: R7.1 17.32,53.44 LED_R.C
N$16
  Top 0.152: LED_G.C 17.52,51.01
  Top 1.016: 17.52,51.01 R8.1
N$17  (via drill 0.35)
  Top 0.152: v4.1,28.75 3.73,29.12 C8.2 4.43,30.49 5.44,31.5 U1.2
  Bottom 0.152: SW1.2 35.06,16.34 35.06,14.65 31.4,10.99 19.35,10.99 16.33,14.01 9.52,14.01 7,16.53 7,25.85 v4.1,28.75
N$18
  Top 0.152: R9.1 5.8,53.32 IC1.2
N$19
  Top 0.152: L1.1 12.98,31.64 10.45,31.64 10.02,32.07 U1.5
N$20  (via drill 0.35)
  Top 0.152: v5.3,38.9 3.67,38.9 Q1.5 | IC2.3 12.4,37 v11.5,37.9
  Bottom 0.152: v11.5,37.9 8.85,37.9 7.85,38.9 v5.3,38.9
N$22
  Top 0.152: Q1.4 9.43,38.9 IC2.1
N$23
  Top 0.152: R11.1 C5.2 8.92,42.97 10.55,44.6 15.7,44.6 16.3,44 16.3,41.7 17.45,40.55 17.45,38.9 16.5,37.95 IC2.5
N$24
  Top 0.152: R10.1 13.29,40.51 14.82,38.98 14.82,38.23 14.55,37.95 IC2.2
P08  (via drill 0.35)
  Top 0.152: v24.8,37.4 25.05,37.65 U$1.P$12 | J7.2 8.6,21.2 10.42,23.02 R4.1 10.42,25.02 v12.05,26.65
  Bottom 0.152: v24.8,37.4 24.8,37.19 24.7,37.09 20.34,37.09 12.05,28.8 v12.05,26.65
P09  (via drill 0.35)
  Top 0.152: v26.15,37.35 26.32,37.52 U$1.P$13 | J8.2 17.23,19.28 R5.1 17.15,23.82 v17.15,25.9
  Bottom 0.152: v17.15,25.9 17.13,25.92 17.13,33.09 20.27,36.22 25.41,36.22 26.15,36.96 v26.15,37.35
P12
  Top 0.152: U$2.4 18.55,25.98 16.42,28.11 16.42,33.7 19.41,36.69 29.3,36.69 30.13,37.52 U$1.P$16
P13
  Top 0.152: U$2.3 18,27.98 16.78,29.2 16.78,33.38 19.62,36.23 30.12,36.23 31.4,37.5 U$1.P$17
P14
  Top 0.152: U$2.2 17.7,29.98 17.28,30.4 17.28,33.35 19.77,35.83 30.93,35.83 32.67,37.57 U$1.P$18
P25
  Top 0.152: S2.NO 39.95,68.38 39.95,64.25 41.43,62.77 41.43,61.17 R2.1 38.58,59.52 37.21,58.15 30,58.15 28.86,57.01 U$1.P$36
P26
  Top 0.152: S3.NO 32.5,67.93 32.5,60.8 33.78,59.52 R3.1 33.6,58.88 29.43,58.88 27.59,57.04 U$1.P$37
P27
  Top 0.152: VR1.A 16.89,69.21 16.89,61.82 R13.1 16.73,61.42 19.27,58.88 24.32,58.88 26.32,56.88 U$1.P$38
P28  (via drill 0.35)
  Top 0.152: VR1.C 13.45,74.65 v13.35,74.75 | v12.01,66.31 12.47,65.84 R12.1 12.47,63.16 13.15,63.84 v14.5,63.84 | v20.1,58.2 23.95,58.2 25.05,57.1 U$1.P$39
  Bottom 0.152: v12.01,66.31 11.81,66.51 11.81,74.05 12.51,74.75 v13.35,74.75 | v20.1,58.2 16.1,58.2 14.5,59.8 v14.5,63.84
P29
  Top 0.152: R1.1 8.59,61.44 | 8.59,61.44 8.59,60.59 8.55,60.55 7.2,60.55 6.9,60.25 6.9,58.45 7.38,57.98 17.23,57.98 19.05,56.15 23.45,56.15 | 23.45,56.15 23.53,56.15 | S1.NO 7.1,68.23 7.1,62.93 8.59,61.44 | U$1.P$40 23.7,55.9 23.45,56.15
SCLK
  Top 0.152: U$1.P$22 37.74,39.38 37.74,37.4 40.84,34.3 J4.1
SDD
  Top 0.152: J4.2 40.82,30.68 39.67,31.83 39.67,34.38 36.48,37.57 U$1.P$21
SHIELD  (5 unrouted)
VDD  (via drill 0.35)
  Top 0.152: 6.94,50.73 IC1.4 7.47,50.77 7.45,50.75 | IC1.8 12.42,54.61 | J1.1 23.65,84.3 23.6,84.25 | 23.42,82.72 23.6,82.9 | LED_G.A
  Top 0.406: 11.45,54.61 11.31,54.48
  Top 0.508: 11.31,54.48 11.31,50.11
  Top 0.61: 11.31,50.11 11.03,49.83 | 23.6,82.9 23.6,84.25
  Top 0.813: 12.42,54.61 11.45,54.61
  Top 1.016: IC1.4 5.28,49.11 C4.2 | 11.03,49.83 7.84,49.83 6.94,50.73 | LED_R.A 17.59,55.74 16.32,57.02 12.82,57.02 v12.49,56.69 12.44,56.63 IC1.8 | J3.2 23.42,82.72 | v15.95,47.55 16.15,47.55 LED_G.A
  Bottom 1.016: J3.2 14.85,80.65 12.14,80.65 5.45,73.96 5.45,59.4 8.16,56.69 v12.49,56.69 15.3,53.88 15.3,48.2 v15.95,47.55

### Text on the board
tPlace: MK II | OptiMice
bPlace: designed by Jason TSE / NYC Spring 2021